# Altium schematic sheet Electromagnet.SchDoc
size A
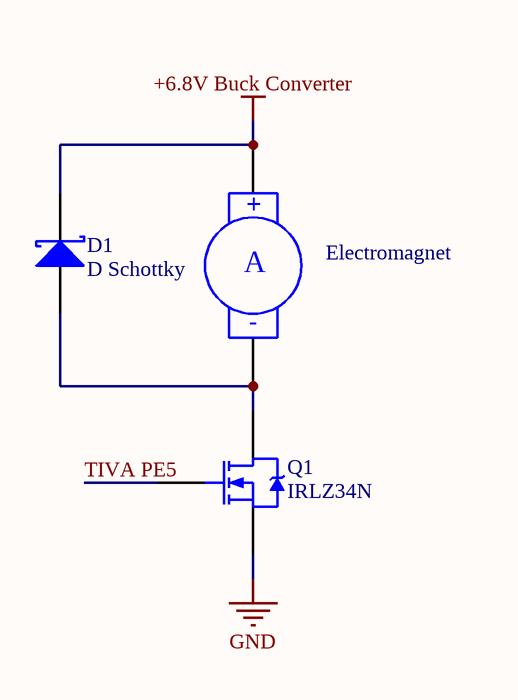
[diagram p0: Electromagnet.SchDoc]

## Parts
B?  Electromagnet  [RAD-0.4]
D1  D Schottky  [DSO-C2/X2.3]
Q1  IRLZ34N  [SFM-T3/A4.7V]

## Nets
+6.8V Buck Converter: B?.1(+) D1.2(K)
GND: Q1.3(S)
TIVA PE5: Q1.1(G)
NetB?_2: B?.2(-) D1.1(A) Q1.2(D)

## Notes on the sheet
- (in symbol Motor Servo) A

## Library data of the parts
B? = Motor Servo: Servo Motor; Manufacturer: Generic Components; Published: 1999
D1 = D Schottky: Schottky Diode; Manufacturer: Generic Components; Class: Discrete; SubClass: Diode - Schottky; Published: 08/06/2000; Publisher: Altium Hobart Technology Centre
Q1 = IRLZ34N: HEXFET Power MOSFET; Manufacturer: International Rectifier; Class: Discrete; SubClass: MOSFET - Power; Note: Pin 2 is electrically connected to pin 4.; Published: 8/06/2000; Publisher: Altium Hobart Technology Centre